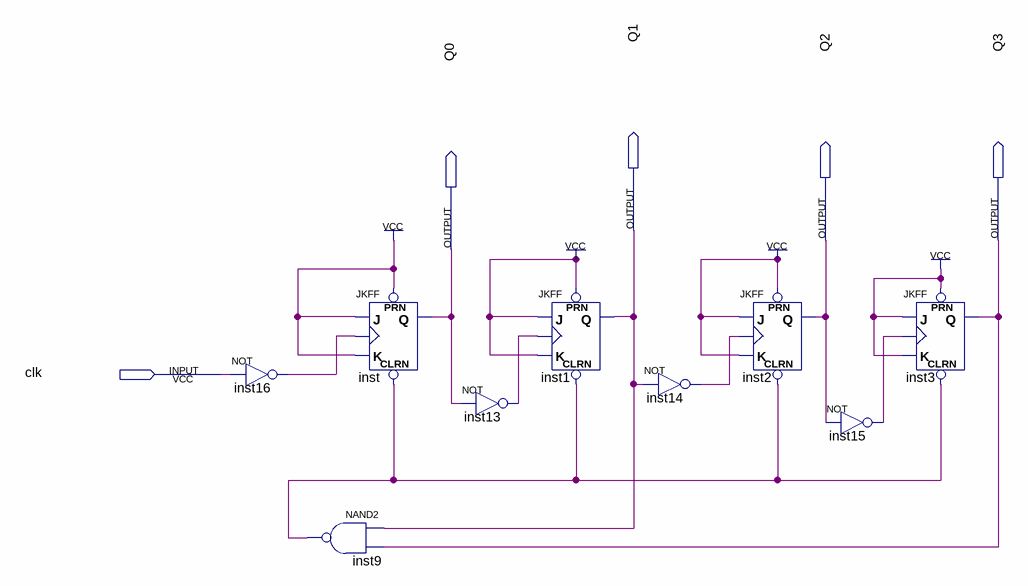
[diagram p0: schematic sheet]
// Quartus schematic RelojRealTIME.bdf as structural Verilog: 9 symbols, 5 pins
module RelojRealTIME (
  input  clk,
  output Q1,
  output Q2,
  output Q3,
  output Q0
);

  wire inst9_out, inst13_out, inst14_out, inst15_out, inst16_out;

  not inst16 (inst16_out, clk);
  nand inst9 (inst9_out, Q1, Q3);
  JKFF inst (.PRN(1'b1), .CLRN(inst9_out), .K(1'b1), .J(1'b1), .CLK(inst16_out), .Q(Q0));
  not inst13 (inst13_out, Q0);
  JKFF inst1 (.PRN(1'b1), .CLRN(inst9_out), .K(1'b1), .J(1'b1), .CLK(inst13_out), .Q(Q1));
  not inst14 (inst14_out, Q1);
  JKFF inst2 (.PRN(1'b1), .CLRN(inst9_out), .K(1'b1), .J(1'b1), .CLK(inst14_out), .Q(Q2));
  not inst15 (inst15_out, Q2);
  JKFF inst3 (.PRN(1'b1), .CLRN(inst9_out), .K(1'b1), .J(1'b1), .CLK(inst15_out), .Q(Q3));
endmodule
